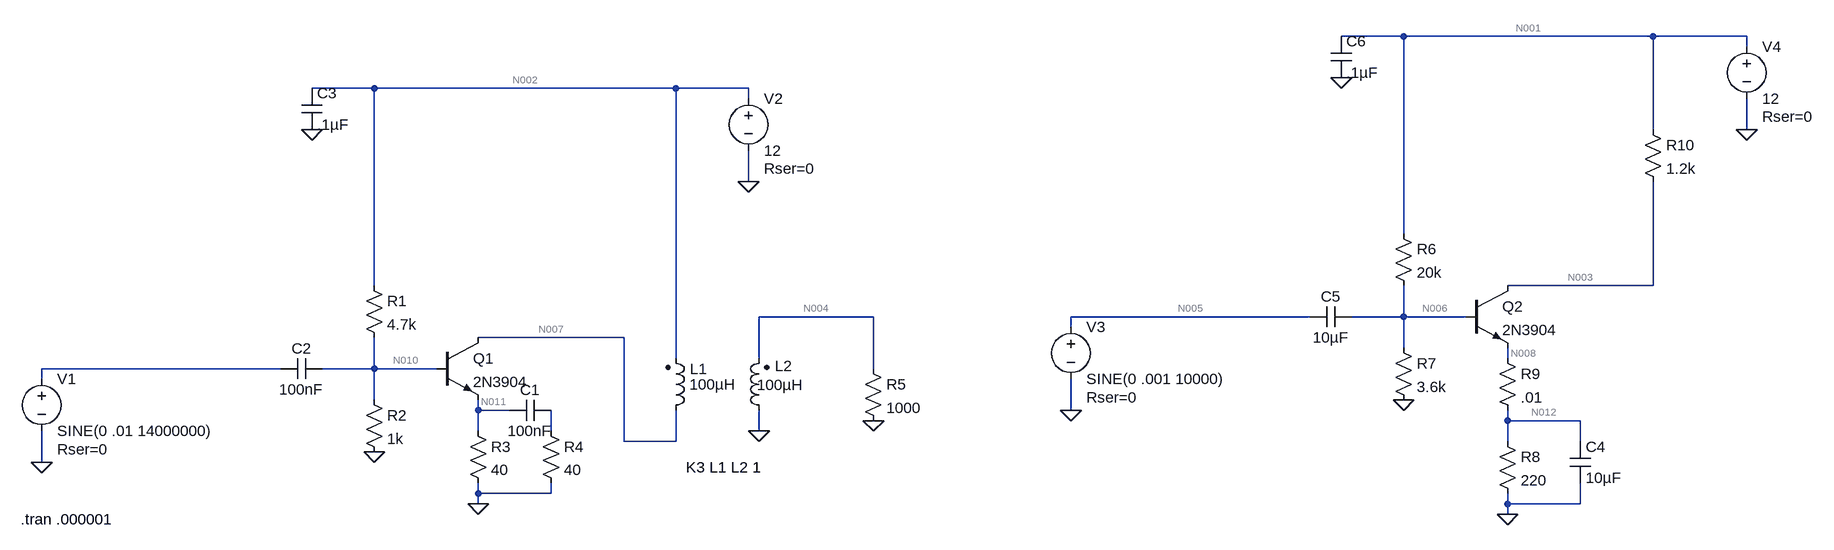
[diagram p0: schematic Collector Feedback.asc]
Collector Feedback.asc, the LTspice schematic file:
Version 4
SHEET 1 2320 680
WIRE 1680 -208 1584 -208
WIRE 2064 -208 1680 -208
WIRE 2208 -208 2064 -208
WIRE 2208 -192 2208 -208
WIRE 96 -128 0 -128
WIRE 560 -128 96 -128
WIRE 672 -128 560 -128
WIRE 672 -112 672 -128
WIRE 2064 -64 2064 -208
WIRE 2208 -64 2208 -112
WIRE 672 16 672 -32
WIRE 1680 96 1680 -208
WIRE 96 176 96 -128
WIRE 2064 176 2064 16
WIRE 2064 176 1840 176
WIRE 864 224 688 224
WIRE 1536 224 1168 224
WIRE 1680 224 1680 176
WIRE 1680 224 1600 224
WIRE 1776 224 1680 224
WIRE 1168 240 1168 224
WIRE 480 256 256 256
WIRE 1680 272 1680 224
WIRE 560 288 560 -128
WIRE 688 288 688 224
WIRE 1840 288 1840 272
WIRE -48 304 -416 304
WIRE 96 304 96 256
WIRE 96 304 16 304
WIRE 192 304 96 304
WIRE 864 304 864 224
WIRE -416 320 -416 304
WIRE 96 352 96 304
WIRE 256 368 256 352
WIRE 304 368 256 368
WIRE 1168 368 1168 320
WIRE 1840 384 1840 368
WIRE 1952 384 1840 384
WIRE 256 400 256 368
WIRE 368 400 368 368
WIRE 688 400 688 368
WIRE 480 416 480 256
WIRE 560 416 560 368
WIRE 560 416 480 416
WIRE 1840 416 1840 384
WIRE 1952 416 1952 384
WIRE -416 448 -416 400
WIRE 256 496 256 480
WIRE 368 496 368 480
WIRE 368 496 256 496
WIRE 256 512 256 496
WIRE 1840 512 1840 496
WIRE 1952 512 1952 480
WIRE 1952 512 1840 512
WIRE 1840 528 1840 512
FLAG -416 448 0
FLAG 96 432 0
FLAG 256 512 0
FLAG 688 400 0
FLAG 0 -64 0
FLAG 864 384 0
FLAG 672 16 0
FLAG 1168 368 0
FLAG 1680 352 0
FLAG 1840 528 0
FLAG 1584 -144 0
FLAG 2208 -64 0
SYMBOL voltage -416 304 R0
WINDOW 123 0 0 Left 0
WINDOW 39 24 124 Left 2
SYMATTR SpiceLine Rser=0
SYMATTR InstName V1
SYMATTR Value SINE(0 .01 14000000)
SYMBOL res 80 160 R0
SYMATTR InstName R1
SYMATTR Value 4.7k
SYMBOL res 80 336 R0
SYMATTR InstName R2
SYMATTR Value 1k
SYMBOL res 240 384 R0
SYMATTR InstName R3
SYMATTR Value 40
SYMBOL cap 368 352 R90
WINDOW 0 0 32 VBottom 2
WINDOW 3 32 32 VTop 2
SYMATTR InstName C1
SYMATTR Value 100nF
SYMBOL res 352 384 R0
SYMATTR InstName R4
SYMATTR Value 40
SYMBOL npn 192 256 R0
SYMATTR InstName Q1
SYMATTR Value 2N3904
SYMBOL cap 16 288 R90
WINDOW 0 0 32 VBottom 2
WINDOW 3 32 32 VTop 2
SYMATTR InstName C2
SYMATTR Value 100nF
SYMBOL ind2 544 384 M180
WINDOW 0 38 80 Left 2
WINDOW 3 37 56 Left 2
SYMATTR InstName L1
SYMATTR Value 100µH
SYMATTR Type ind
SYMBOL ind2 704 384 R180
WINDOW 0 -36 84 Left 2
WINDOW 3 -52 55 Left 2
SYMATTR InstName L2
SYMATTR Value 100µH
SYMATTR Type ind
SYMBOL cap -16 -128 R0
SYMATTR InstName C3
SYMATTR Value .1µF
SYMBOL res 848 288 R0
SYMATTR InstName R5
SYMATTR Value 1000
SYMBOL voltage 672 -128 R0
WINDOW 123 0 0 Left 0
WINDOW 39 24 124 Left 2
SYMATTR SpiceLine Rser=0
SYMATTR InstName V2
SYMATTR Value 12
SYMBOL voltage 1168 224 R0
WINDOW 123 0 0 Left 0
WINDOW 39 24 124 Left 2
SYMATTR SpiceLine Rser=0
SYMATTR InstName V3
SYMATTR Value SINE(0 .001 10000)
SYMBOL res 1664 80 R0
SYMATTR InstName R6
SYMATTR Value 20k
SYMBOL res 1664 256 R0
SYMATTR InstName R7
SYMATTR Value 3.6k
SYMBOL res 1824 400 R0
SYMATTR InstName R8
SYMATTR Value 220
SYMBOL npn 1776 176 R0
SYMATTR InstName Q2
SYMATTR Value 2N3904
SYMBOL cap 1600 208 R90
WINDOW 0 0 32 VBottom 2
WINDOW 3 32 32 VTop 2
SYMATTR InstName C5
SYMATTR Value 10µF
SYMBOL cap 1568 -208 R0
SYMATTR InstName C6
SYMATTR Value .1µF
SYMBOL voltage 2208 -208 R0
WINDOW 123 0 0 Left 0
WINDOW 39 24 124 Left 2
SYMATTR SpiceLine Rser=0
SYMATTR InstName V4
SYMATTR Value 12
SYMBOL res 2048 -80 R0
SYMATTR InstName R10
SYMATTR Value 1.2k
SYMBOL cap 1936 416 R0
SYMATTR InstName C4
SYMATTR Value 10µF
SYMBOL res 1824 272 R0
SYMATTR InstName R9
SYMATTR Value .01
TEXT 576 456 Left 2 !K3 L1 L2 1
TEXT -448 536 Left 2 !.tran .000001

The netlist it stands for:
* Collector Feedback.asc
V1 N009 0 SINE(0 .01 14000000) Rser=0
R1 N002 N010 4.7k
R2 N010 0 1k
R3 N011 0 40
C1 N013 N011 100nF
R4 N013 0 40
Q1 N007 N010 N011 0 2N3904
C2 N010 N009 100nF
L1 N007 N002 100µH
L2 0 N004 100µH
C3 N002 0 .1µF
R5 N004 0 1000
V2 N002 0 12 Rser=0
V3 N005 0 SINE(0 .001 10000) Rser=0
R6 N001 N006 20k
R7 N006 0 3.6k
R8 N012 0 220
Q2 N003 N006 N008 0 2N3904
C5 N006 N005 10µF
C6 N001 0 .1µF
V4 N001 0 12 Rser=0
R10 N001 N003 1.2k
C4 N012 0 10µF
R9 N008 N012 .01
.model NPN NPN
.model PNP PNP
.lib standard.bjt
K3 L1 L2 1
.tran .000001
.backanno
.end

* Results of the author's LTspice run, read from the files saved beside the schematic
* Operating Point, zero values left out:
*   V(n002) = 12 V
*   V(n010) = 2.02 V
*   V(n011) = 1.271 V
*   V(n007) = 12 V
*   V(n001) = 12 V
*   V(n006) = 1.782 V
*   V(n012) = 1.086 V
*   V(n003) = 6.098 V
*   V(n008) = 1.086 V
*   Ic(Q2) = 4.919 mA
*   Ib(Q2) = 15.9 µA
*   Ie(Q2) = -4.935 mA
*   Ic(Q1) = 31.68 mA
*   Ib(Q1) = 102.9 µA
*   Ie(Q1) = -31.78 mA
*   I(L1) = -31.68 mA
*   I(R9) = 4.935 mA
*   I(R10) = 4.919 mA
*   I(R8) = 4.935 mA
*   I(R7) = 495 µA
*   I(R6) = 510.9 µA
*   I(R3) = 31.78 mA
*   I(R2) = 2.02 mA
*   I(R1) = 2.123 mA
*   I(V4) = -5.43 mA
*   I(V2) = -33.8 mA
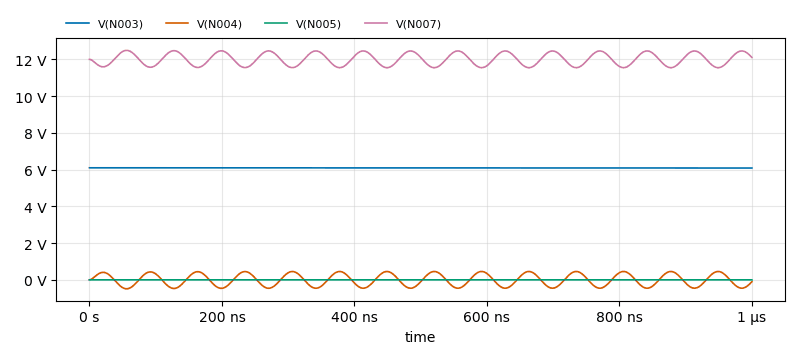
[diagram p1: Transient Analysis of Collector Feedback.asc, plotted from the saved traces]
* Transient Analysis, 1 run:
*   V(N003): min 6.085 V, max 6.098 V, average 6.091 V, rms 6.091 V, last 6.085 V
*   V(N004): min -487.8 mV, max 454.2 mV, average -5.082 mV, rms 320.9 mV, last -103.2 mV
*   V(N005): min 0 V, max 62.79 µV, average 31.41 µV, rms 36.26 µV, last 62.79 µV
*   V(N007): min 11.55 V, max 12.49 V, average 12.01 V, rms 12.01 V, last 12.1 V